# Altium schematic sheet nrf52810_qfaa.SchDoc: nRF52810-QFAA Reference Layout
size A2; Revision: 1.0; SheetNumber: 1; SheetTotal: 1; DrawnBy: RUBR; DocumentSize: A4; PCAName: nRF52810-QFAA Reference Layout
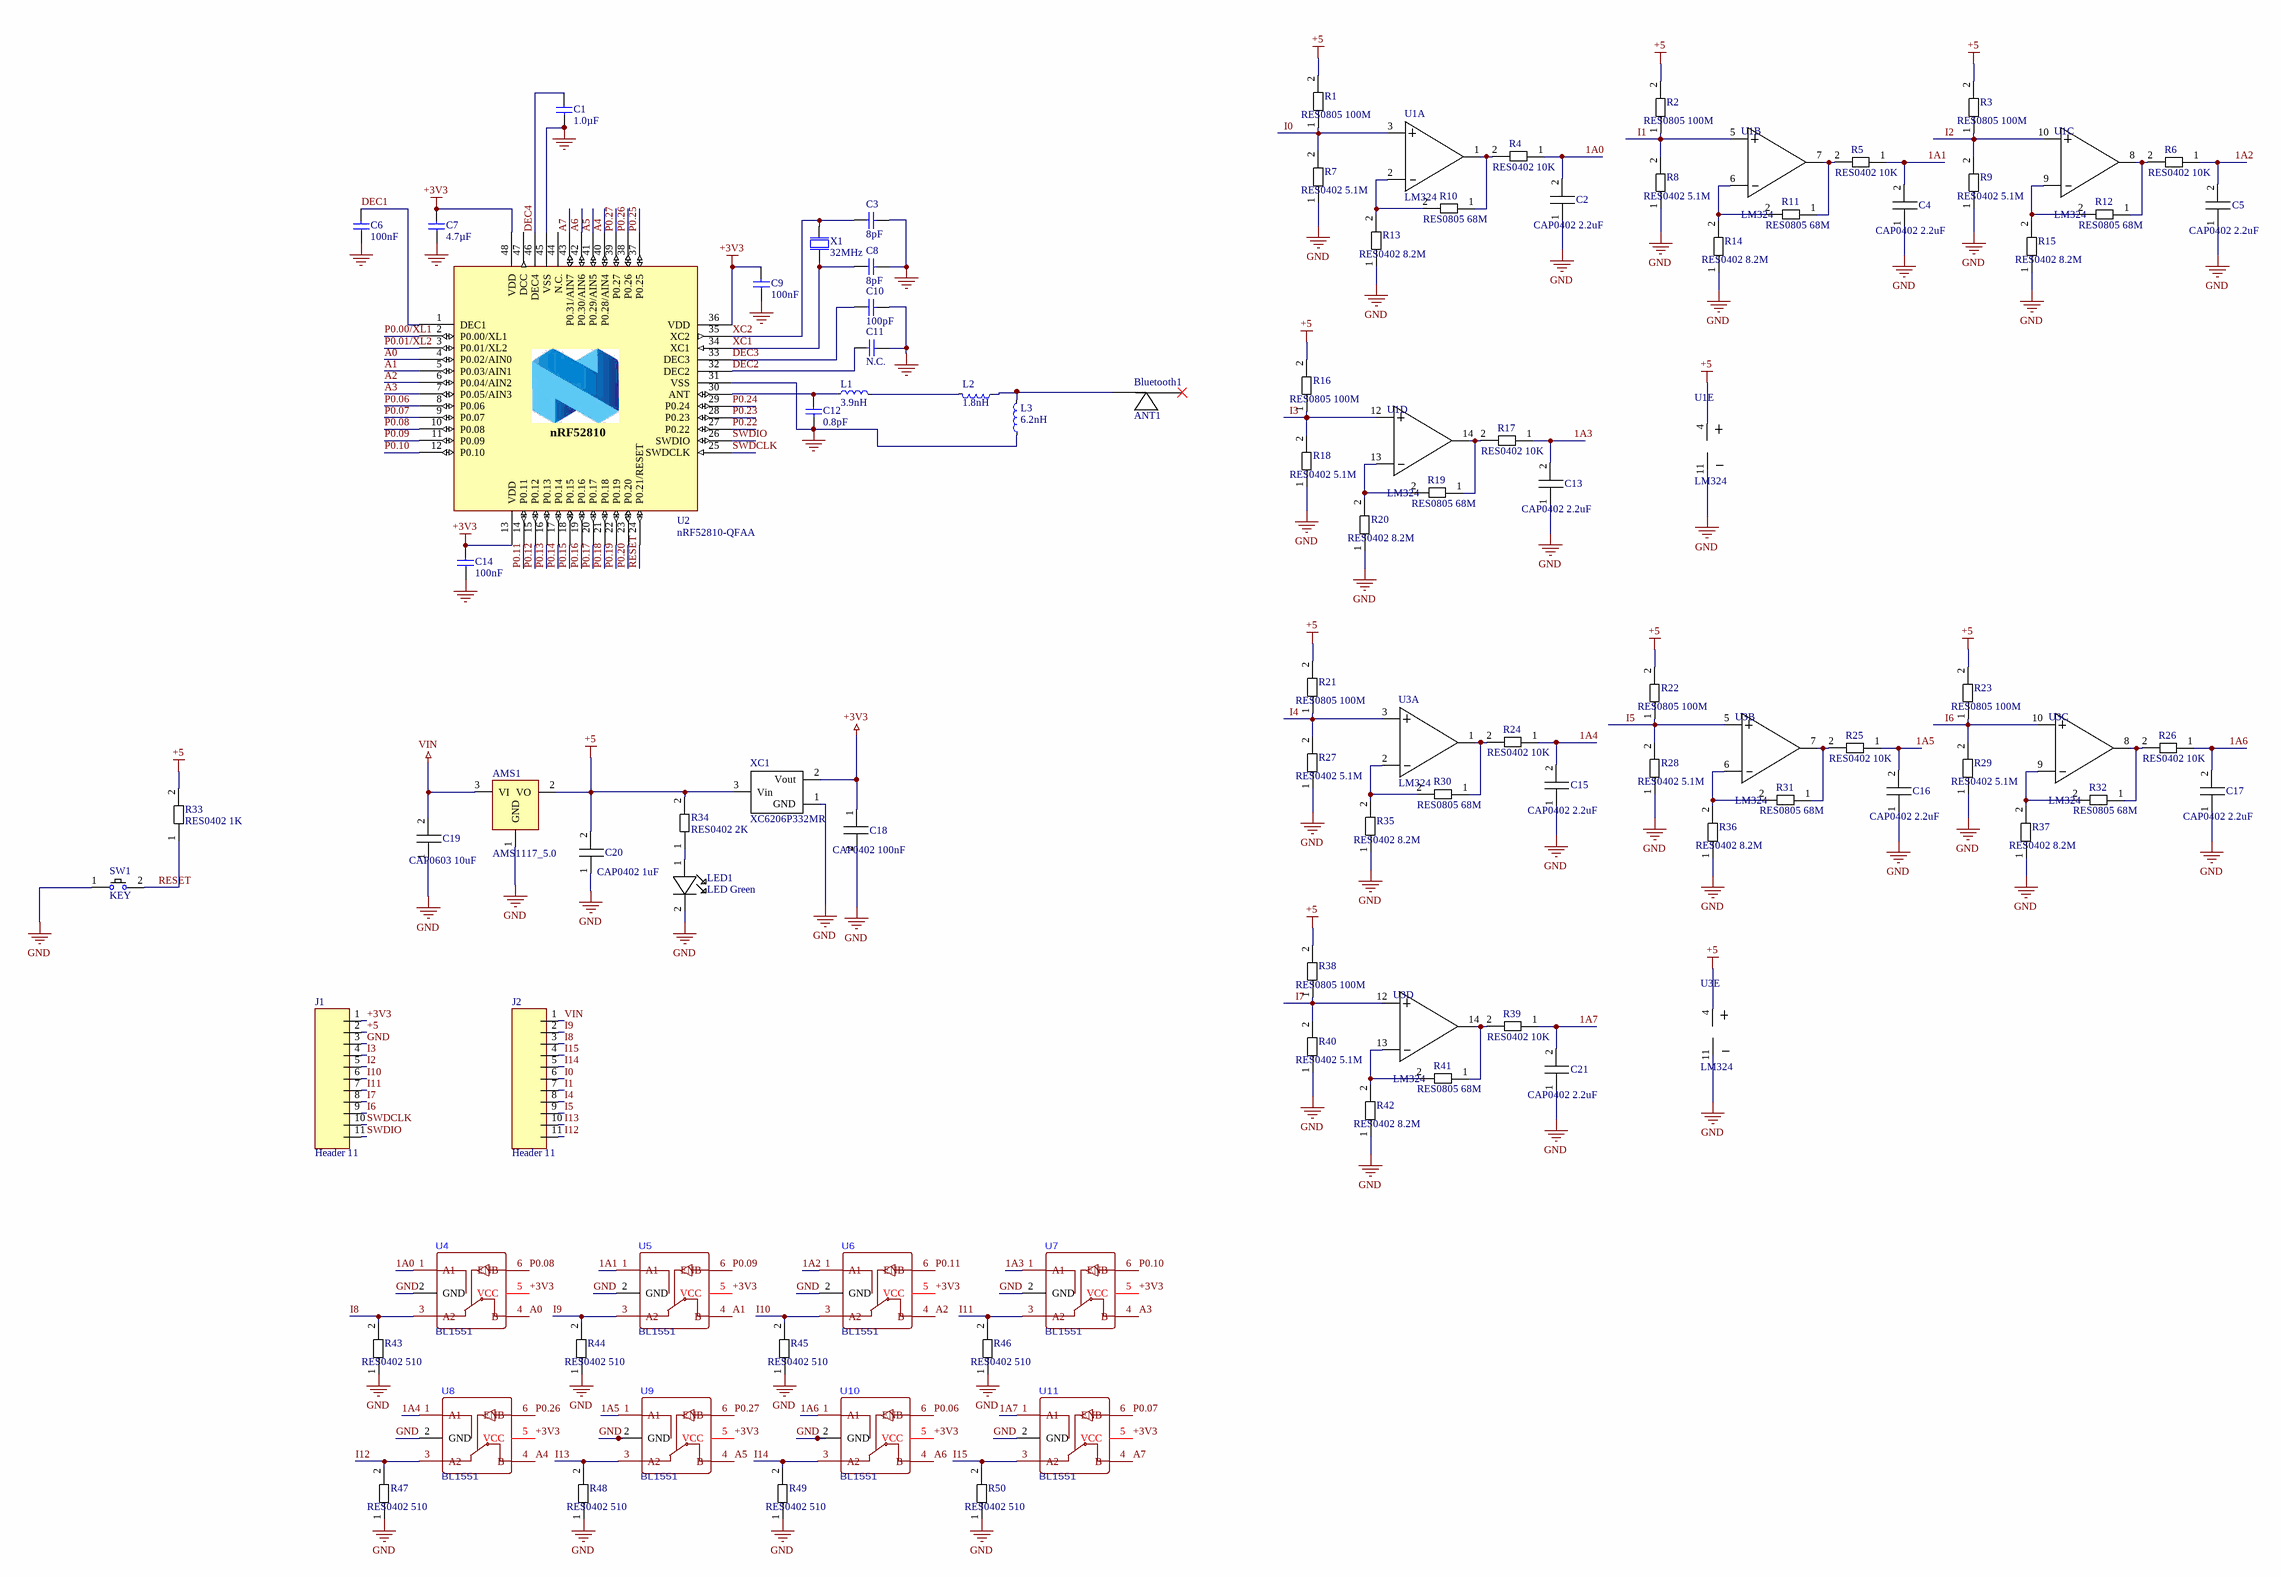
[diagram p0: nrf52810_qfaa.SchDoc]

## Parts
AMS1  AMS1117_5.0  [AMS1117_SOT89]
Bluetooth1  ANT1  [ANT]
C1  1.0µF  [CAPC1608X06L]
C2  CAP0402 2.2uF  [CAP0402]
C3  8pF  [CAPC1005X04L]
C4  CAP0402 2.2uF  [CAP0402]
C5  CAP0402 2.2uF  [CAP0402]
C6  100nF  [CAPC1005X04L]
C7  4.7µF  [CAPC1608X06L]
C8  8pF  [CAPC1005X04L]
C9  100nF  [CAPC1005X04L]
C10  100pF  [CAPC1005X04L]
C11  N.C.  [CAPC1005X04L]
C12  0.8pF  [CAPC1005X04L]
C13  CAP0402 2.2uF  [CAP0402]
C14  100nF  [CAPC1005X04L]
C15  CAP0402 2.2uF  [CAP0402]
C16  CAP0402 2.2uF  [CAP0402]
C17  CAP0402 2.2uF  [CAP0402]
C18  CAP0402 100nF  [CAP0402]
C19  CAP0603 10uF  [CAP0603]
C20  CAP0402 1uF  [CAP0402]
C21  CAP0402 2.2uF  [CAP0402]
J1  Header 11  [PIN11]
J2  Header 11  [PIN11]
L1  3.9nH  [INDC1005X04L]
L2  1.8nH  [INDC1608X06L]
L3  6.2nH  [INDC1608X06L]
LED1  LED Green  [LED0603]
R1  RES0805 100M  [RES0805]
R2  RES0805 100M  [RES0805]
R3  RES0805 100M  [RES0805]
R4  RES0402 10K  [RES0402]
R5  RES0402 10K  [RES0402]
R6  RES0402 10K  [RES0402]
R7  RES0402 5.1M  [RES0402]
R8  RES0402 5.1M  [RES0402]
R9  RES0402 5.1M  [RES0402]
R10  RES0805 68M  [RES0805]
R11  RES0805 68M  [RES0805]
R12  RES0805 68M  [RES0805]
R13  RES0402 8.2M  [RES0402]
R14  RES0402 8.2M  [RES0402]
R15  RES0402 8.2M  [RES0402]
R16  RES0805 100M  [RES0805]
R17  RES0402 10K  [RES0402]
R18  RES0402 5.1M  [RES0402]
R19  RES0805 68M  [RES0805]
R20  RES0402 8.2M  [RES0402]
R21  RES0805 100M  [RES0805]
R22  RES0805 100M  [RES0805]
R23  RES0805 100M  [RES0805]
R24  RES0402 10K  [RES0402]
R25  RES0402 10K  [RES0402]
R26  RES0402 10K  [RES0402]
R27  RES0402 5.1M  [RES0402]
R28  RES0402 5.1M  [RES0402]
R29  RES0402 5.1M  [RES0402]
R30  RES0805 68M  [RES0805]
R31  RES0805 68M  [RES0805]
R32  RES0805 68M  [RES0805]
R33  RES0402 1K  [RES0402]
R34  RES0402 2K  [RES0402]
R35  RES0402 8.2M  [RES0402]
R36  RES0402 8.2M  [RES0402]
R37  RES0402 8.2M  [RES0402]
R38  RES0805 100M  [RES0805]
R39  RES0402 10K  [RES0402]
R40  RES0402 5.1M  [RES0402]
R41  RES0805 68M  [RES0805]
R42  RES0402 8.2M  [RES0402]
R43  RES0402 510  [RES0402]
R44  RES0402 510  [RES0402]
R45  RES0402 510  [RES0402]
R46  RES0402 510  [RES0402]
R47  RES0402 510  [RES0402]
R48  RES0402 510  [RES0402]
R49  RES0402 510  [RES0402]
R50  RES0402 510  [RES0402]
SW1  KEY  [SW-SMD_L3.9-W3.0-P4.45]
U1  LM324  [LM324PWR]  (parts A,B,C,D,E of 5)
U2  nRF52810-QFAA  [QFN40P600X600X90-48N]
U3  LM324  [LM324PWR]  (parts A,B,C,D,E of 5)
U4  BL1551  [SC-70-6_L2.2-W1.3-P0.65-LS2.1-BR]
U5  BL1551  [SC-70-6_L2.2-W1.3-P0.65-LS2.1-BR]
U6  BL1551  [SC-70-6_L2.2-W1.3-P0.65-LS2.1-BR]
U7  BL1551  [SC-70-6_L2.2-W1.3-P0.65-LS2.1-BR]
U8  BL1551  [SC-70-6_L2.2-W1.3-P0.65-LS2.1-BR]
U9  BL1551  [SC-70-6_L2.2-W1.3-P0.65-LS2.1-BR]
U10  BL1551  [SC-70-6_L2.2-W1.3-P0.65-LS2.1-BR]
U11  BL1551  [SC-70-6_L2.2-W1.3-P0.65-LS2.1-BR]
X1  32MHz  [BT-XTAL_2016]
XC1  XC6206P332MR  [XC6206P332MR]

## Nets
+3V3: C7.1 C9.1 C14.1 C18.1 J1.1 U2.13(VDD) U2.36(VDD) U2.48(VDD) U4.5(VCC) U5.5(VCC) U6.5(VCC) U7.5(VCC) U8.5(VCC) U9.5(VCC) U10.5(VCC) U11.5(VCC) XC1.2(Vout)
+5: AMS1.2(VO) C20.2 J1.2 R1.2 R2.2 R3.2 R16.2 R21.2 R22.2 R23.2 R33.2 R34.2 R38.2 U1.4 U3.4 XC1.3(Vin)
GND: AMS1.1(GND) C1.1 C2.1 C3.2 C4.1 C5.1 C6.2 C7.2 C8.2 C9.2 C10.2 C11.1 C12.1 C13.1 C14.2 C15.1 C16.1 C17.1 C18.2 C19.1 C20.1 C21.1 J1.3 L3.1 LED1.2 R7.1 R8.1 R9.1 R13.1 R14.1 R15.1 R18.1 R20.1 R27.1 R28.1 R29.1 R35.1 R36.1 R37.1 R40.1 R42.1 R43.1 R44.1 R45.1 R46.1 R47.1 R48.1 R49.1 R50.1 SW1.1(GND) U1.11 U2.31(VSS) U2.45(VSS) U2.49(GND) U3.11 U4.2(GND) U5.2(GND) U6.2(GND) U7.2(GND) U8.2(GND) U9.2(GND) U10.2(GND) U11.2(GND) X1.2(GND) X1.4(GND) XC1.1(GND)
VIN: AMS1.3(VI) C19.2 J2.1
1A0: C2.2 R4.1 U4.1(A1)
1A1: C4.2 R5.1 U5.1(A1)
1A2: C5.2 R6.1 U6.1(A1)
1A3: C13.2 R17.1 U7.1(A1)
1A4: C15.2 R24.1 U8.1(A1)
1A5: C16.2 R25.1 U9.1(A1)
1A6: C17.2 R26.1 U10.1(A1)
1A7: C21.2 R39.1 U11.1(A1)
A0: U2.4(P0.02/AIN0) U4.4(B)
A1: U2.5(P0.03/AIN1) U5.4(B)
A2: U2.6(P0.04/AIN2) U6.4(B)
A3: U2.7(P0.05/AIN3) U7.4(B)
A4: U2.40(P0.28/AIN4) U8.4(B)
A5: U2.41(P0.29/AIN5) U9.4(B)
A6: U2.42(P0.30/AIN6) U10.4(B)
A7: U2.43(P0.31/AIN7) U11.4(B)
DEC1: C6.1 U2.1(DEC1)
DEC2: C11.2 U2.32(DEC2)
DEC3: C10.1 U2.33(DEC3)
DEC4: C1.2 U2.46(DEC4)
I0: J2.6 R1.1 R7.2 U1.3(PD0(RXD))
I1: J2.7 R2.1 R8.2 U1.5(PD0(RXD))
I2: J1.5 R3.1 R9.2 U1.10(PD0(RXD))
I3: J1.4 R16.1 R18.2 U1.12(PD0(RXD))
I4: J2.8 R21.1 R27.2 U3.3(PD0(RXD))
I5: J2.9 R22.1 R28.2 U3.5(PD0(RXD))
I6: J1.9 R23.1 R29.2 U3.10(PD0(RXD))
I7: J1.8 R38.1 R40.2 U3.12(PD0(RXD))
I8: J2.3 R43.2 U4.3(A2)
I9: J2.2 R44.2 U5.3(A2)
I10: J1.6 R45.2 U6.3(A2)
I11: J1.7 R46.2 U7.3(A2)
I12: J2.11 R47.2 U8.3(A2)
I13: J2.10 R48.2 U9.3(A2)
I14: J2.5 R49.2 U10.3(A2)
I15: J2.4 R50.2 U11.3(A2)
P0.00/XL1: U2.2(P0.00/XL1)
P0.01/XL2: U2.3(P0.01/XL2)
P0.06: U2.8(P0.06) U10.6(ENB)
P0.07: U2.9(P0.07) U11.6(ENB)
P0.08: U2.10(P0.08) U4.6(ENB)
P0.09: U2.11(P0.09) U5.6(ENB)
P0.10: U2.12(P0.10) U7.6(ENB)
P0.11: U2.14(P0.11) U6.6(ENB)
P0.12: U2.15(P0.12)
P0.13: U2.16(P0.13)
P0.14: U2.17(P0.14)
P0.15: U2.18(P0.15)
P0.16: U2.19(P0.16)
P0.17: U2.20(P0.17)
P0.18: U2.21(P0.18)
P0.19: U2.22(P0.19)
P0.20: U2.23(P0.20)
P0.22: U2.27(P0.22)
P0.23: U2.28(P0.23)
P0.24: U2.29(P0.24)
P0.25: U2.37(P0.25)
P0.26: U2.38(P0.26) U8.6(ENB)
P0.27: U2.39(P0.27) U9.6(ENB)
RESET: R33.1 SW1.2(GND) U2.24(P0.21/RESET)
SWDCLK: J1.10 U2.25(SWDCLK)
SWDIO: J1.11 U2.26(SWDIO)
XC1: C8.1 U2.34(XC1) X1.1(inp)
XC2: C3.1 U2.35(XC2) X1.3(out)
NetBluetooth1_2: Bluetooth1.2 L2.1 L3.2
NetC12_2: C12.2 L1.1 U2.30(ANT)
NetL1_2: L1.2 L2.2
NetLED1_1: LED1.1 R34.1
NetR4_2: R4.2 R10.1 U1.1(PD0(RXD))
NetR5_2: R5.2 R11.1 U1.7(PD0(RXD))
NetR6_2: R6.2 R12.1 U1.8(PD0(RXD))
NetR10_2: R10.2 R13.2 U1.2(PD0(RXD))
NetR11_2: R11.2 R14.2 U1.6(PD0(RXD))
NetR12_2: R12.2 R15.2 U1.9(PD0(RXD))
NetR17_2: R17.2 R19.1 U1.14(PD0(RXD))
NetR19_2: R19.2 R20.2 U1.13(PD0(RXD))
NetR24_2: R24.2 R30.1 U3.1(PD0(RXD))
NetR25_2: R25.2 R31.1 U3.7(PD0(RXD))
NetR26_2: R26.2 R32.1 U3.8(PD0(RXD))
NetR30_2: R30.2 R35.2 U3.2(PD0(RXD))
NetR31_2: R31.2 R36.2 U3.6(PD0(RXD))
NetR32_2: R32.2 R37.2 U3.9(PD0(RXD))
NetR39_2: R39.2 R41.1 U3.14(PD0(RXD))
NetR41_2: R41.2 R42.2 U3.13(PD0(RXD))

Not connected (* = marked no-connect by the designer): Bluetooth1 1*; U2 44(N.C.) 47(DCC)

## Notes on the sheet
- Title
- Size
- Date:
- Project Number
- Sheet         of
- Revision
- File:
- Drawn By:
- (in symbol nRF52810-QFAABB) nRF52810

## Library data of the parts
Bluetooth1 = BLUETOOTH_ANT: PCB板载天线; 版权归属: 源创客; BOM名称: PCB板载天线; 学习资源: www.ooocke.com
C1 = C0603-1µ0: Capacitor, X7R, ±10%; Note: 16V; Part Number: C0603-1µ0; LatestRevisionDate: 2013-06-05; Pin Count: 2; Publisher: Nordic Semiconductor; Published: 2009-05-08; Value: 1.0µF; Footprint Doc: 0603; Manufacturer: *; Manufacturer Part Number: *
C2 C4 C5 C13 C15-C18 C20 C21 = CAP0402
C3 C8 = C0402-12p: Capacitor, NP0, ±2%; Value: 12pF; Note: 50V; Part Number: C0402-12p; LatestRevisionDate: 2011-05-11; Pin Count: 2; Publisher: Nordic Semiconductor; Published: 2009-05-08; Footprint Doc: 0402; Manufacturer: *; Manufacturer Part Number: *
C6 C9 C14 = C0402-100n: Capacitor, X7R, ±10%; Note: 16V; Part Number: C0402-100n; LatestRevisionDate: 2009-11-23; Pin Count: 2; Publisher: Nordic Semiconductor; Published: 2009-05-08; Value: 100nF; Footprint Doc: 0402; Manufacturer: *; Manufacturer Part Number: *
C7 = C0603-4µ7: Capacitor, X5R, ±10%; Note: 6.3V; Part Number: C0603-4µ7; LatestRevisionDate: 2009-11-23; Pin Count: 2; Publisher: Nordic Semiconductor; Published: 2009-05-08; Value: 4.7µF; Footprint Doc: 0603; Manufacturer: *; Manufacturer Part Number: *
C10 = C0402-100p: Capacitor, NP0, ±5%; Note: 50V; Part Number: C0402-100p; LatestRevisionDate: 2009-05-08; Pin Count: 2; Publisher: Nordic Semiconductor; Published: 2009-05-08; Value: 100pF; Footprint Doc: 0402; Manufacturer: *; Manufacturer Part Number: *
C11 = C0402-N.C.: Not mounted; Assembly: Not mounted; Part Number: C0402-N.C.; LatestRevisionDate: 2009-05-08; Pin Count: 2; Publisher: Nordic Semiconductor; Published: 2009-05-08; Value: N.C.; Footprint Doc: 0402; Manufacturer: *; Manufacturer Part Number: *
C12 = C0402-0.8p: Capacitor, NP0, ±5%; Note: 50V; Part Number: C0402-0.8p; LatestRevisionDate: 2012-11-21; Pin Count: 2; Publisher: Nordic Semiconductor; Published: 2009-05-08; Value: 0.8pF; Footprint Doc: 0402; Manufacturer: *; Manufacturer Part Number: *
C19 = CAP0603
L1 = L0402-3n9: High frequency chip inductor ±5%; Part Number: L0402-3n9; LatestRevisionDate: 2012-09-19; Pin Count: 2; Publisher: Nordic Semiconductor; Published: 2009-05-08; Value: 3.9nH; Footprint Doc: 0402
L2 L3 = L0402-3n9: High frequency chip inductor ±5%; Value: 3.9nH; Part Number: L0402-3n9; LatestRevisionDate: 2012-09-19; Pin Count: 2; Publisher: Nordic Semiconductor; Published: 2009-05-08; Footprint Doc: 0402
LED1 = LED
R1-R3 R10-R12 R16 R19 R21-R23 R30-R32 R38 R41 = RES0805
R4-R9 R13-R15 R17 R18 R20 R24-R29 R33-R37 R39 R40 R42-R50 = RES0402
U2 = nRF52810-QFAABB: Multi-protocol Bluetooth Low Energy, ANT and 2.4GHz proprietary system-on-chip; Manufacturer: Nordic Semiconductor; Note: nRF52810 - QFN48 6x6 0.4mm pitch; Part Number: nRF52810-QFAABB; LatestRevisionDate: 2017-06-09; Pin Count: 48; Publisher: Nordic Semiconductor; Published: 2017-06-09; Value: nRF52810-QFAA; Footprint Doc: QFN-48; Manufacturer Part Number: nRF52810-QFAABB
X1 = XTAL_SMD2016_32MHz_8pF_General: XTAL SMD 2016, 32MHz, Cl=8pF, Total Tol: ±40ppm; Part Number: XTAL_SMD2016_32MHz_8pF_General; LatestRevisionDate: 2016-08-19; Pin Count: 4; Publisher: Nordic Semiconductor; Published: 2016-08-19; Value: 32MHz; Footprint Doc: XTAL_2016; Manufacturer: *; Manufacturer Part Number: *